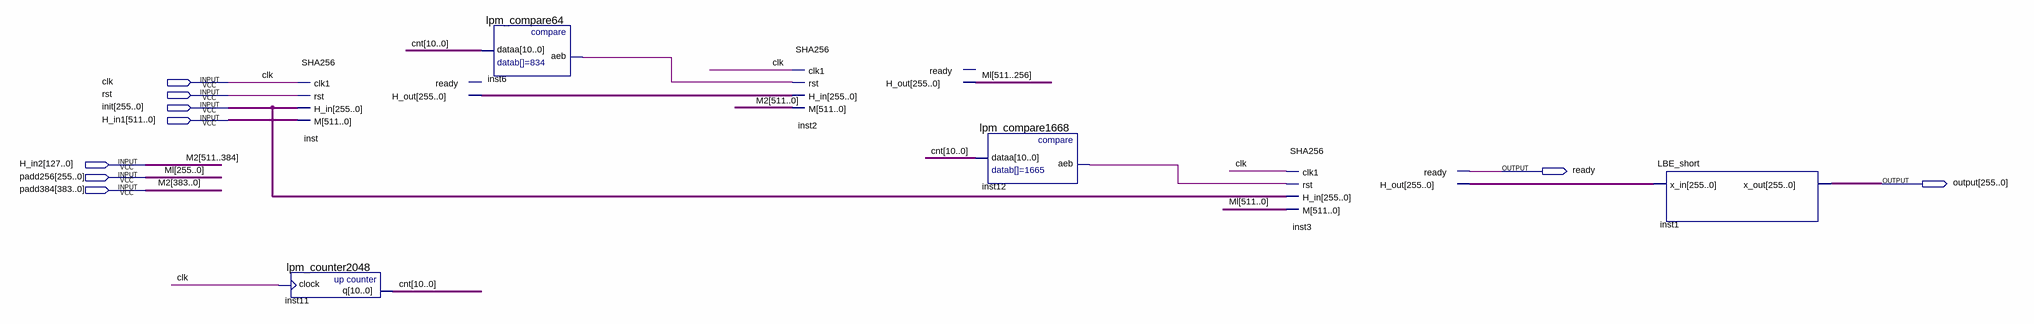
[diagram p0: schematic sheet]
// Quartus schematic SHAd.bdf as structural Verilog: 7 symbols, 9 pins
module SHAd (
  input  clk,
  input  rst,
  input  [255:0] init,
  input  [511:0] H_in1,
  input  [127:0] H_in2,
  input  [255:0] padd256,
  input  [383:0] padd384,
  output ready,
  output [255:0] \output 
);

  wire inst6_aeb, inst12_aeb;
  wire [10:0] cnt;
  wire [255:0] inst3_h_out, inst_h_out;
  wire [511:256] Ml;

  SHA256 inst (.clk1(clk), .rst(rst), .H_in(init), .M(H_in1), .H_out(inst_h_out));  // open: ready
  lpm_counter2048 inst11 (.clock(clk), .q(cnt));
  lpm_compare64 inst6 (.dataa(cnt), .aeb(inst6_aeb));
  SHA256 inst2 (.clk1(clk), .rst(inst6_aeb), .H_in(inst_h_out), .M({H_in2, padd384}), .H_out(Ml));  // open: ready
  lpm_compare1668 inst12 (.dataa(cnt), .aeb(inst12_aeb));
  SHA256 inst3 (.clk1(clk), .rst(inst12_aeb), .H_in(init), .M({Ml, padd256}), .ready(ready), .H_out(inst3_h_out));
  LBE_short inst1 (.x_in(inst3_h_out), .x_out(\output ));

  // Other names for the same wires on the sheet: M2[511:0] = {H_in2, padd384}; Ml[255:0] = padd256
endmodule
